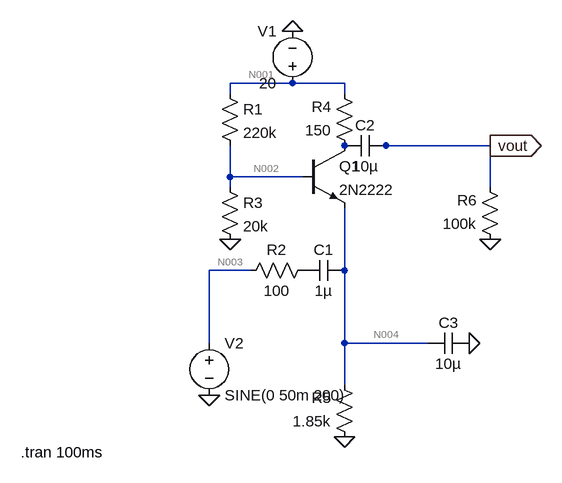
[diagram p0: schematic base.asc]
base.asc, the LTspice schematic file:
Version 4
SHEET 1 880 680
WIRE 192 64 96 64
WIRE 272 64 192 64
WIRE 96 80 96 64
WIRE 272 80 272 64
WIRE 336 160 320 160
WIRE 496 160 336 160
WIRE 96 208 96 160
WIRE 208 208 96 208
WIRE 96 224 96 208
WIRE 496 224 496 160
WIRE 128 352 64 352
WIRE 272 352 272 256
WIRE 64 464 64 352
WIRE 272 464 272 352
WIRE 400 464 272 464
WIRE 272 528 272 464
FLAG 272 608 0
FLAG 496 304 0
FLAG 192 -16 0
FLAG 64 544 0
FLAG 464 464 0
FLAG 496 160 vout
IOPIN 496 160 Out
FLAG 96 304 0
SYMBOL res 80 64 R0
SYMATTR InstName R1
SYMATTR Value 220k
SYMBOL voltage 192 80 R180
WINDOW 0 24 96 Left 2
WINDOW 3 24 16 Left 2
WINDOW 123 0 0 Left 0
WINDOW 39 0 0 Left 0
SYMATTR InstName V1
SYMATTR Value 20
SYMBOL cap 272 336 R90
WINDOW 0 0 32 VBottom 2
WINDOW 3 32 32 VTop 2
SYMATTR InstName C1
SYMATTR Value 1µ
SYMBOL cap 336 144 R90
WINDOW 0 0 32 VBottom 2
WINDOW 3 32 32 VTop 2
SYMATTR InstName C2
SYMATTR Value 10µ
SYMBOL res 224 336 R90
WINDOW 0 0 56 VBottom 2
WINDOW 3 32 56 VTop 2
SYMATTR InstName R2
SYMATTR Value 100
SYMBOL res 288 176 R180
WINDOW 0 36 76 Left 2
WINDOW 3 36 40 Left 2
SYMATTR InstName R4
SYMATTR Value 150
SYMBOL res 288 624 R180
WINDOW 0 36 76 Left 2
WINDOW 3 36 40 Left 2
SYMATTR InstName R5
SYMATTR Value 1.85k
SYMBOL res 512 320 R180
WINDOW 0 36 76 Left 2
WINDOW 3 36 40 Left 2
SYMATTR InstName R6
SYMATTR Value 100k
SYMBOL voltage 64 448 R0
WINDOW 123 0 0 Left 0
WINDOW 39 0 0 Left 0
SYMATTR InstName V2
SYMATTR Value SINE(0 50m 200)
SYMBOL cap 464 448 R90
WINDOW 0 0 32 VBottom 2
WINDOW 3 32 32 VTop 2
SYMATTR InstName C3
SYMATTR Value 10µ
SYMBOL npn 208 160 R0
SYMATTR InstName Q1
SYMATTR Value 2N2222
SYMBOL res 80 208 R0
SYMATTR InstName R3
SYMATTR Value 20k
TEXT -226 632 Left 2 !.tran 100ms

The netlist it stands for:
* base.asc
R1 N001 N002 220k
V1 N001 0 20
C1 N004 P001 1µ
C2 vout P002 10µ
R2 P001 N003 100
R4 P002 N001 150
R5 0 N004 1.85k
R6 0 vout 100k
V2 N003 0 SINE(0 50m 200)
C3 0 N004 10µ
Q1 P002 N002 N004 0 2N2222
R3 N002 0 20k
.model NPN NPN
.model PNP PNP
.lib standard.bjt
.tran 100ms
.backanno
.end

* Results of the author's LTspice run, read from the files saved beside the schematic
* Operating Point, zero values left out:
*   V(n001) = 20 V
*   V(n002) = 1.625 V
*   V(n004) = 990.6 mV
*   V(p002) = 19.92 V
*   Ic(Q1) = 533.2 µA
*   Ib(Q1) = 2.257 µA
*   Ie(Q1) = -535.5 µA
*   I(R3) = 81.26 µA
*   I(R5) = -535.5 µA
*   I(R4) = -533.2 µA
*   I(R1) = 83.52 µA
*   I(V1) = -616.7 µA
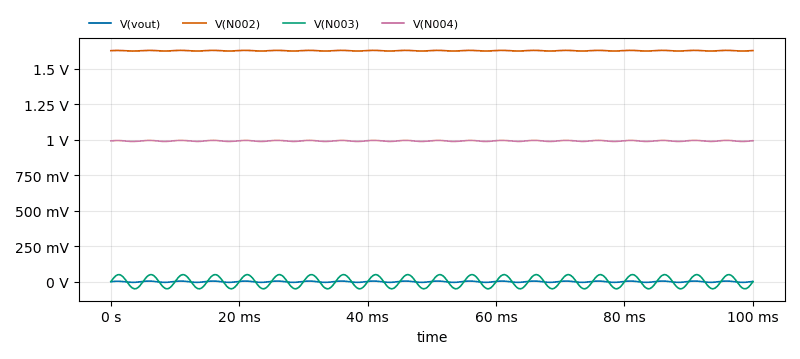
[diagram p1: Transient Analysis of base.asc, plotted from the saved traces]
* Transient Analysis, 1 run:
*   V(vout): min -4.734 mV, max 4.491 mV, average -34.97 µV, rms 3.176 mV, last 1.911 mV
*   V(N002): min 1.623 V, max 1.628 V, average 1.625 V, rms 1.625 V, last 1.626 V
*   V(N003): min -49.88 mV, max 49.88 mV, average -66.54 nV, rms 35.23 mV, last 0 V
*   V(N004): min 986.7 mV, max 994.4 mV, average 990.6 mV, rms 990.6 mV, last 992.2 mV